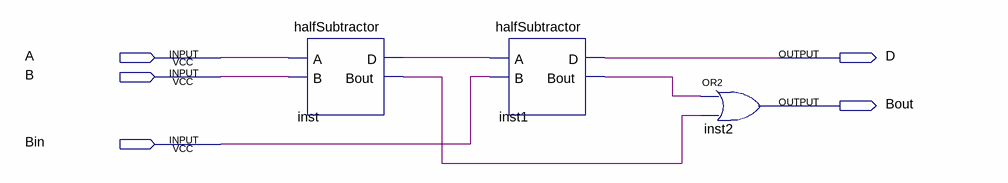
[diagram p0: schematic sheet]
// Quartus schematic fullSubtractor.bdf as structural Verilog: 3 symbols, 5 pins
module fullSubtractor (
  input  A,
  input  B,
  input  Bin,
  output D,
  output Bout
);

  wire inst1_bout, inst_bout, inst_d;

  halfSubtractor inst (.A(A), .B(B), .D(inst_d), .Bout(inst_bout));
  halfSubtractor inst1 (.A(inst_d), .B(Bin), .D(D), .Bout(inst1_bout));
  or inst2 (Bout, inst1_bout, inst_bout);
endmodule
